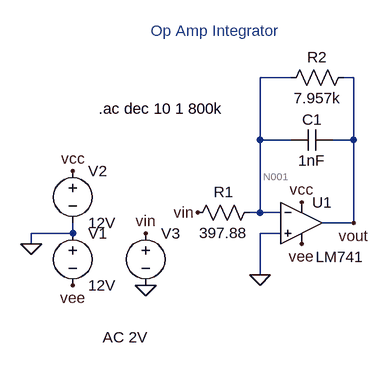
[diagram p0: schematic op_amp_integrator_2.asc]
op_amp_integrator_2.asc, the LTspice schematic file:
Version 4.1
SHEET 1 880 680
WIRE 352 -80 304 -80
WIRE 448 -80 432 -80
WIRE 304 16 304 -80
WIRE 352 16 304 16
WIRE 448 16 448 -80
WIRE 448 16 416 16
WIRE 304 128 304 16
WIRE 304 128 288 128
WIRE 336 128 304 128
WIRE 448 144 448 16
WIRE 448 144 400 144
WIRE 16 160 16 144
WIRE 16 160 -48 160
WIRE 336 160 304 160
WIRE -48 176 -48 160
WIRE 304 224 304 160
FLAG -48 176 0
FLAG 368 112 vcc
FLAG 16 64 vcc
FLAG 368 176 vee
FLAG 16 240 vee
FLAG 304 224 0
FLAG 448 144 vout
FLAG 128 240 0
FLAG 128 160 vin
FLAG 208 128 vin
SYMBOL voltage 16 144 R0
WINDOW 123 0 0 Left 0
WINDOW 39 0 0 Left 0
SYMATTR InstName V1
SYMATTR Value 12V
SYMBOL voltage 16 48 R0
WINDOW 123 0 0 Left 0
WINDOW 39 0 0 Left 0
SYMATTR InstName V2
SYMATTR Value 12V
SYMBOL LM741 368 80 R0
WINDOW 3 22 116 Left 2
SYMATTR InstName U1
SYMBOL res 304 112 R90
WINDOW 0 0 56 VBottom 2
WINDOW 3 32 56 VTop 2
SYMATTR InstName R1
SYMATTR Value 397.88
SYMBOL cap 416 0 R90
WINDOW 0 0 32 VBottom 2
WINDOW 3 32 32 VTop 2
SYMATTR InstName C1
SYMATTR Value 1nF
SYMBOL res 448 -96 R90
WINDOW 0 0 56 VBottom 2
WINDOW 3 32 56 VTop 2
SYMATTR InstName R2
SYMATTR Value 7.957k
SYMBOL voltage 128 144 R0
WINDOW 3 -66 148 Left 2
WINDOW 123 -66 176 Left 2
WINDOW 39 0 0 Left 0
SYMATTR InstName V3
SYMATTR Value ""
SYMATTR Value2 AC 2V
TEXT 56 -32 Left 2 !.ac dec 10 1 800k
TEXT 136 -152 Left 2 ;Op Amp Integrator

The netlist it stands for:
* op_amp_integrator_2.asc
V1 0 vee 12V
V2 vcc 0 12V
X§U1 0 N001 vcc vee vout LM741  ; pins In+ In- V+ V- OUT
R1 N001 vin 397.88
C1 vout N001 1nF
R2 vout N001 7.957k
V3 vin 0 AC 2V
.ac dec 10 1 800k
* Op Amp Integrator
.lib LM741.lib
.backanno
.end

* Results of the author's LTspice run, read from the files saved beside the schematic
* Operating Point, zero values left out:
*   V(vcc) = 12 V
*   V(vout) = 21.81 mV
*   V(vee) = -12 V
*   V(n001) = 999.9 µV
*   I(V1) = -1.625 mA
*   I(V3) = 2.513 µA
*   I(R2) = 2.615 µA
*   I(V2) = -1.627 mA
*   I(R1) = 2.513 µA
*   Ix(u1:1) = 57.86 nA
*   Ix(u1:2) = 101.9 nA
*   Ix(u1:99) = 1.627 mA
*   Ix(u1:50) = -1.625 mA
*   Ix(u1:28) = -2.615 µA